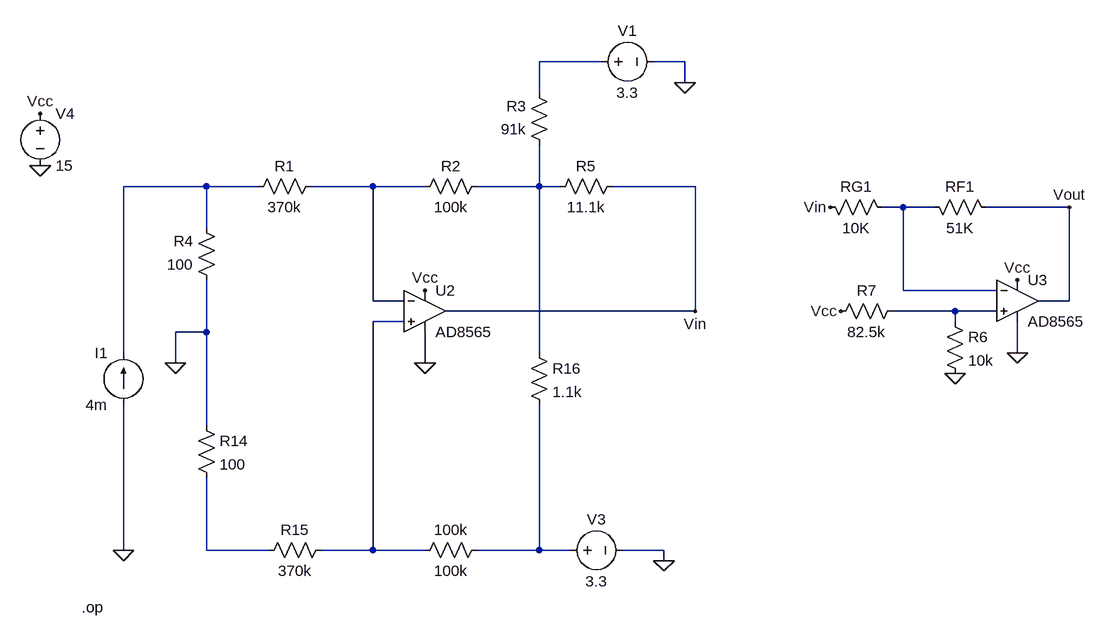
[diagram p0: schematic Proje1.asc]
Proje1.asc, the LTspice schematic file:
Version 4
SHEET 1 2600 852
WIRE 384 -128 288 -128
WIRE 512 -128 464 -128
WIRE 512 -96 512 -128
WIRE 288 -80 288 -128
WIRE -224 64 -352 64
WIRE -144 64 -224 64
WIRE 32 64 -64 64
WIRE 112 64 32 64
WIRE 288 64 288 0
WIRE 288 64 192 64
WIRE 320 64 288 64
WIRE 528 64 400 64
WIRE 848 96 816 96
WIRE 896 96 848 96
WIRE 1104 96 976 96
WIRE -224 128 -224 64
WIRE 848 224 848 96
WIRE 992 224 848 224
WIRE 32 240 32 64
WIRE 80 240 32 240
WIRE 1104 240 1104 96
WIRE 1104 240 1056 240
WIRE 528 256 528 64
WIRE 528 256 144 256
WIRE 928 256 832 256
WIRE 992 256 928 256
WIRE 80 272 32 272
WIRE 928 272 928 256
WIRE -224 288 -224 208
WIRE -224 288 -272 288
WIRE -352 320 -352 64
WIRE 288 320 288 64
WIRE 1024 320 1024 272
WIRE -272 336 -272 288
WIRE 112 336 112 288
WIRE -224 432 -224 288
WIRE -352 624 -352 400
WIRE -224 624 -224 512
WIRE -128 624 -224 624
WIRE 32 624 32 272
WIRE 32 624 -48 624
WIRE 112 624 32 624
WIRE 288 624 288 400
WIRE 288 624 192 624
WIRE 336 624 288 624
WIRE 480 624 416 624
WIRE 480 640 480 624
FLAG 512 -96 0
FLAG 480 640 0
FLAG 112 336 0
FLAG 112 224 Vcc
FLAG -480 32 0
FLAG -480 -48 Vcc
FLAG 1024 320 0
FLAG 928 352 0
FLAG 1024 208 Vcc
FLAG 752 256 Vcc
FLAG 736 96 Vin
FLAG 528 256 Vin
FLAG 1104 96 Vout
FLAG -272 336 0
FLAG -352 624 0
SYMBOL res -48 48 R90
WINDOW 0 0 56 VBottom 2
WINDOW 3 32 56 VTop 2
SYMATTR InstName R1
SYMATTR Value 370k
SYMBOL res 208 48 R90
WINDOW 0 0 56 VBottom 2
WINDOW 3 32 56 VTop 2
SYMATTR InstName R2
SYMATTR Value 100k
SYMBOL res 304 16 R180
WINDOW 0 36 76 Left 2
WINDOW 3 36 40 Left 2
SYMATTR InstName R3
SYMATTR Value 91k
SYMBOL res -208 224 R180
WINDOW 0 36 76 Left 2
WINDOW 3 36 40 Left 2
SYMATTR InstName R4
SYMATTR Value 100
SYMBOL voltage 368 -128 R270
WINDOW 0 32 56 VTop 2
WINDOW 3 -32 56 VBottom 2
WINDOW 123 0 0 Left 0
WINDOW 39 0 0 Left 0
SYMATTR InstName V1
SYMATTR Value 3.3
SYMBOL res 416 48 R90
WINDOW 0 0 56 VBottom 2
WINDOW 3 32 56 VTop 2
SYMATTR InstName R5
SYMATTR Value 11.1k
SYMBOL res -240 416 R0
SYMATTR InstName R14
SYMATTR Value 100
SYMBOL res -32 608 R90
WINDOW 0 0 56 VBottom 2
WINDOW 3 32 56 VTop 2
SYMATTR InstName R15
SYMATTR Value 370k
SYMBOL res 272 304 R0
SYMATTR InstName R16
SYMATTR Value 1.1k
SYMBOL res 208 608 R90
WINDOW 0 0 56 VBottom 2
WINDOW 3 32 56 VTop 2
SYMATTR InstName 100k
SYMATTR Value 100k
SYMBOL voltage 320 624 R270
WINDOW 0 32 56 VTop 2
WINDOW 3 -32 56 VBottom 2
WINDOW 123 0 0 Left 0
WINDOW 39 0 0 Left 0
SYMATTR InstName V3
SYMATTR Value 3.3
SYMBOL current -352 400 R180
WINDOW 0 24 80 Left 2
WINDOW 3 24 0 Left 2
WINDOW 123 0 0 Left 0
WINDOW 39 0 0 Left 0
SYMATTR InstName I1
SYMATTR Value 4m
SYMBOL voltage -480 -64 R0
SYMATTR InstName V4
SYMATTR Value 15
SYMBOL res 912 256 R0
SYMATTR InstName R6
SYMATTR Value 10k
SYMBOL res 848 240 R90
WINDOW 0 0 56 VBottom 2
WINDOW 3 32 56 VTop 2
SYMATTR InstName R7
SYMATTR Value 82.5k
SYMBOL res 992 112 M270
WINDOW 0 32 56 VTop 2
WINDOW 3 0 56 VBottom 2
SYMATTR InstName RF1
SYMATTR Value 51K
SYMBOL res 832 112 M270
WINDOW 0 32 56 VTop 2
WINDOW 3 0 56 VBottom 2
SYMATTR InstName RG1
SYMATTR Value 10K
SYMBOL Opamps\\AD8565 112 192 R0
SYMATTR InstName U2
SYMBOL Opamps\\AD8565 1024 176 R0
SYMATTR InstName U3
TEXT -416 712 Left 2 !.op

The netlist it stands for:
* Proje1.asc
R1 N003 N002 370k
R2 N004 N003 100k
R3 N004 N001 91k
R4 0 N002 100
V1 N001 0 3.3
R5 Vin N004 11.1k
R14 0 N008 100
R15 N007 N008 370k
R16 N004 N009 1.1k
R§100k N009 N007 100k
V3 N009 0 3.3
I1 0 N002 4m
V4 Vcc 0 15
R6 N006 0 10k
R7 N006 Vcc 82.5k
RF1 Vout N005 51K
RG1 N005 Vin 10K
XU2 N007 N003 Vcc 0 Vin AD8565  ; pins In+ In- V+ V- OUT
XU3 N006 N005 Vcc 0 Vout AD8565  ; pins In+ In- V+ V- OUT
.op
.backanno
.end